# EAGLE schematic MPPT Charge Controller (EAGLE 9.6.2)
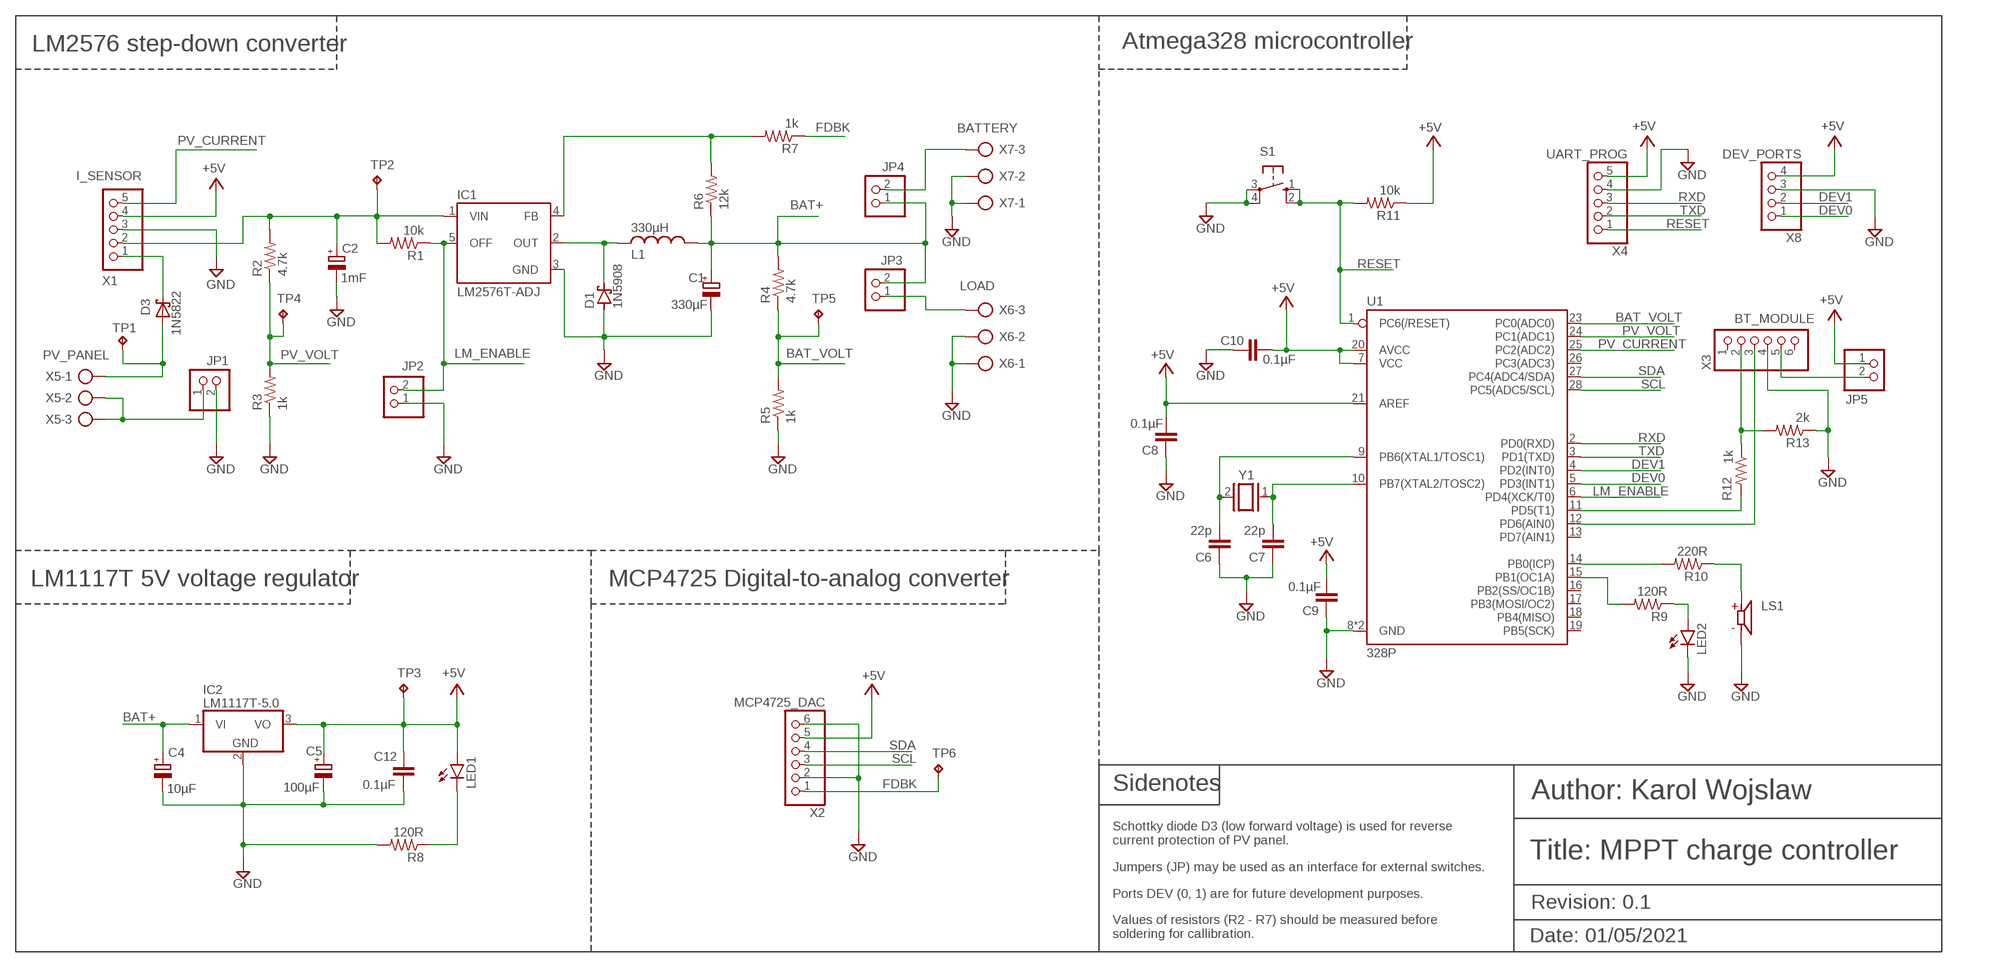
[diagram p0: schematic, sheet 1]

## Parts
C1  330µF  CPOL-EUE2-5  [E2-5]
C2  1mF  CPOL-EUE2-5  [E2-5]
C4  10µF  CPOL-EUE2-5  [E2-5]
C5  100µF  CPOL-EUE2-5  [E2-5]
C6  22p  C-EU025-025X050  [C025-025X050]
C7  22p  C-EU025-025X050  [C025-025X050]
C8  0.1µF  C2.5/2  [C2.5-2]
C9  0.1µF  C-EU025-025X050  [C025-025X050]
C10  0.1µF  C-EU025-025X050  [C025-025X050]
C12  0.1µF  C-EU025-025X050  [C025-025X050]
D1  1N5908  SCHOTTKY-DIODEDO201T15  [DO201T15]
D3  1N5822  SCHOTTKY-DIODEDO201T15  [DO201T15]
IC1  LM2576T-ADJ  LM2576T  [TO220-5]
IC2  LM1117T-5.0  7805TV  [TO220V]
JP1  PINHD-1X2  [1X02]
JP2  PINHD-1X2  [1X02]
JP3  PINHD-1X2  [1X02]
JP4  PINHD-1X2  [1X02]
JP5  PINHD-1X2  [1X02]
L1  330µH  L-US6000-XXX-RC  [6000-XXXX-RC]
LED1  LED5MM  [LED5MM]
LED2  LED5MM  [LED5MM]
LS1  CEM-1205C  [CUI_CEM-1205C]
R1  10k  R-US_0207/10  [0207/10]
R2  4.7k  R-US_0207/10  [0207/10]
R3  1k  R-US_0207/10  [0207/10]
R4  4.7k  R-US_0207/10  [0207/10]
R5  1k  R-US_0207/10  [0207/10]
R6  12k  R-US_0207/10  [0207/10]
R7  1k  R-US_0207/10  [0207/10]
R8  120R  R-US_0207/10  [0207/10]
R9  120R  R-US_0207/10  [0207/10]
R10  220R  R-US_0207/10  [0207/10]
R11  10k  R-US_0207/10  [0207/10]
R12  1k  R-US_0207/10  [0207/10]
R13  2k  R-US_0207/10  [0207/10]
S1  10-XX  [B3F-10XX]
TP1  TPPAD1-13  [P1-13]
TP2  TPPAD1-13  [P1-13]
TP3  TPPAD1-13  [P1-13]
TP4  TPPAD1-13  [P1-13]
TP5  TPPAD1-13  [P1-13]
TP6  TPPAD1-13  [P1-13]
U1  328P  ATMEGA328P_PDIP  [DIP28]
X1  I_SENSOR  PINHD-1X5  [1X05]
X2  MCP4725_DAC  PINHD-1X6  [1X06]
X3  BT_MODULE  PINHD-1X6  [1X06]
X4  UART_PROG  PINHD-1X5  [1X05]
X5  PV_PANEL  AK300/3  [AK300/3]
X6  LOAD  AK500/3  [AK500/3]
X7  BATTERY  AK500/3  [AK500/3]
X8  DEV_PORTS  PINHD-1X4  [1X04]
Y1  16MHz  XTAL/S  [QS]

## Nets
+5V: C5.+ C8.2 C9.2 C10.2 C12.2 IC2.3(VO) JP5.1 LED1.A R11.1 TP3.TP U1.7(VCC) U1.20(AVCC) U1.21(AREF) X1.4 X2.5 X4.5 X8.4
BAT+: C1.+ C4.+ IC2.1(VI) JP3.2 JP4.1 L1.1 R4.2 R6.1
BAT_VOLT: R4.1 R5.2 TP5.TP U1.23(PC0(ADC0))
BT_TXD: U1.12(PD6(AIN0)) X3.3
DEV0: U1.5(PD3(INT1)) X8.1
DEV1: U1.4(PD2(INT0)) X8.2
FDBK: R7.1 TP6.TP X2.1
GND: C1.- C2.- C4.- C5.- C6.1 C7.1 C8.1 C9.1 C10.1 C12.1 D1.A IC1.3(GND) IC2.2(GND) JP1.2 JP2.1 LED2.K(C) LS1.N R3.1 R5.1 R8.2 R13.1 S1.3(P) S1.4(P1) U1.8(GND) U1.22(GND) X1.3 X2.2 X2.6 X3.4 X4.4 X6.1 X6.2 X7.1 X7.2 X8.3
LM_ENABLE: IC1.5(OFF) JP2.2 R1.1 U1.6(PD4(XCK/T0))
LM_FEEDBACK: IC1.4(FB) R6.2 R7.2
LM_VIN: C2.+ IC1.1(VIN) R1.2 R2.2 TP2.TP X1.2
N$1: D1.C IC1.2(OUT) L1.2
N$2: D3.A TP1.TP X5.1
N$3: D3.C X1.1
N$4: LED1.K(C) R8.1
N$5: JP1.1 X5.2 X5.3
N$6: JP3.1 X6.3
N$7: C6.2 U1.9(PB6(XTAL1/TOSC1)) Y1.2
N$8: R10.2 U1.14(PB0(ICP))
N$10: JP4.2 X7.3
N$11: R9.2 U1.15(PB1(OC1A))
N$12: LED2.A R9.1
N$14: LS1.P R10.1
N$15: R12.2 U1.11(PD5(T1))
N$16: R12.1 R13.2 X3.2
N$18: JP5.2 X3.5
N$19: C7.2 U1.10(PB7(XTAL2/TOSC2)) Y1.1
PV_CURRENT: U1.25(PC2(ADC2)) X1.5
PV_VOLT: R2.1 R3.2 TP4.TP U1.24(PC1(ADC1))
RESET: R11.2 S1.1(S) S1.2(S1) U1.1(PC6(/RESET)) X4.1
RXD: U1.2(PD0(RXD)) X4.3
SCL: U1.28(PC5(ADC5/SCL)) X2.3
SDA: U1.27(PC4(ADC4/SDA)) X2.4
TXD: U1.3(PD1(TXD)) X4.2
Unconnected: U1.13(PD7(AIN1)) U1.16(PB2(SS/OC1B)) U1.17(PB3(MOSI/OC2)) U1.18(PB4(MISO)) U1.19(PB5(SCK)) U1.26(PC3(ADC3)) X3.1 X3.6

## Notes on the sheet
- LM2576 step-down converter | Atmega328 microcontroller
- LM1117T 5V voltage regulator | MCP4725 Digital-to-analog converter
- Sidenotes
- Author: Karol Wojslaw
- Schottky diode D3 (low forward voltage) is used for reverse
  current protection of PV panel.
- Title: MPPT charge controller
- Jumpers (JP) may be used as an interface for external switches.
- Ports DEV (0, 1) are for future development purposes.
- Revision: 0.1
- Values of resistors (R2 - R7) should be measured before
  soldering for callibration.
- Date: 01/05/2021

## Library data of the parts
C1 C2 C4 C5 = rcl:CPOL-EU: POLARIZED CAPACITOR, European symbol; SPICEPREFIX: C
C6 C7 C9 C10 C12 = rcl:C-EU: CAPACITOR, European symbol; SPICEPREFIX: C
C8 = capacitor-wima:C: CAPACITOR naming: grid - package width
D1 = diode:SCHOTTKY-DIODE: Schottky Diode
D3 = adafruit:SCHOTTKY-DIODE: Schottky Diode
IC1 = LM2576_eagle_lib:LM2576: National Semiconductor <http://www.national.com> 3.0A "Simple Switcher"(c) 52kHz, Vout 1.23-37V (HV: 57V), Vin 40V (HV: 60V), 50µA standby current
IC2 = linear:78*: Positive VOLTAGE REGULATOR Source: http://cache.national.com/ds/LM/LM78L05.pdf http://www.fairchildsemi.com/ds/LM/LM7805.pdf
JP1-JP5 = pinhead:PINHD-1X2: PIN HEADER
L1 = rcl:L-US: INDUCTOR, American symbol; SPICEPREFIX: L
LED1 LED2 = led:LED: LED OSRAM: - CHIPLED LG R971, LG N971, LY N971, LG Q971, LY Q971, LO R971, LY R971 LH N974, LH R974 LS Q976, LO Q976, LY Q976 LO Q996 - Hyper CHIPLED LW Q18S LB Q993, LB Q99A, LB R99A - SideLED LS A670, LO A670, LY A670, LG A670, LP A670 LB A673, LV A673, LT A673, LW A673 LH A674 LY A675 LS A676, LA A676, LO A676, LY A676, LW A676 LS A679, LY A679, LG A679 - Hyper Micro SIDELED® LS Y876, LA Y876, LO Y876, LY Y876 LT Y87S - SmartLED LW L88C, LW L88S LB L89C, LB L89S, LG L890 LS L89K, LO L89K, LY L89K LS L896, LA L896, LO L896, LY L896 - TOPLED LS T670, LO T670, LY T670, LG T670, LP T670 LSG T670, LSP T670, LSY T670, LOP T670, LYG T670 LG T671, LOG T671, LSG T671 LB T673, LV T673, LT T673, LW T673 LH T674 LS T676, LA T676, LO T676, LY T676, LB T676, LH T676, LSB T676, LW T676 LB T67C, LV T67C, LT T67C, LS T67K, LO T67K, LY T67K, LW E67C LS E67B, LA E67B, LO E67B, LY E67B, LB E67C, LV E67C, LT E67C LW T67C LS T679, LY T679, LG T679 LS T770, LO T770, LY T770, LG T770, LP T770 LB T773, LV T773, LT T773, LW T773 LH T774 LS E675, LA E675, LY E675, LS T675 LS T776, LA T776, LO T776, LY T776, LB T776 LHGB T686 LT T68C, LB T68C - Hyper Mini TOPLED® LB M676 - Mini TOPLED Santana® LG M470 LS M47K, LO M47K, LY M47K Source: http://www.osram.convergy.de LUXEON: - LUMILED® LXK2-PW12-R00, LXK2-PW12-S00, LXK2-PW14-U00, LXK2-PW14-V00 LXK2-PM12-R00, LXK2-PM12-S00, LXK2-PM14-U00 LXK2-PE12-Q00, LXK2-PE12-R00, LXK2-PE12-S00, LXK2-PE14-T00, LXK2-PE14-U00 LXK2-PB12-K00, LXK2-PB12-L00, LXK2-PB12-M00, LXK2-PB14-N00, LXK2-PB14-P00, LXK2-PB14-Q00 LXK2-PR12-L00, LXK2-PR12-M00, LXK2-PR14-Q00, LXK2-PR14-R00 LXK2-PD12-Q00, LXK2-PD12-R00, LXK2-PD12-S00 LXK2-PH12-R00, LXK2-PH12-S00 LXK2-PL12-P00, LXK2-PL12-Q00, LXK2-PL12-R00 Source: www.luxeon.com KINGBRIGHT: KA-3528ASYC Source: www.kingbright.com
LS1 = CEM-1205C:CEM-1205C: 12 mm, 5 V, 85 dB, Through Hole, Sealed, Driving Circuit, Magnetic Audio Indicator Buzzer Check prices <https://pricing.snapeda.com/parts/CEM-1205C/CUI%20Devices/view-part?ref=eda>; AVAILABILITY: Good; CUI_PURCHASE_URL: https://www.cuidevices.com/product/audio/buzzers/audio-indicators/cem-1205c?utm_source=snapeda.com&utm_medium=referral&utm_campaign=snapedaBOM; DESCRIPTION: 12 mm, 5 V, 85 dB, Through Hole, Sealed, Driving Circuit, Magnetic Audio Indicator Buzzer; MF: CUI Devices; MP: CEM-1205C; PACKAGE: TO-220 CUI Inc.; PRICE: None; PURCHASE-URL: https://pricing.snapeda.com/search/part/CEM-1205C/?ref=eda
R1-R13 = rcl:R-US_: RESISTOR, American symbol; SPICEPREFIX: R
S1 = switch-omron:10-XX: OMRON SWITCH; MPN: B3F-1000; OC_FARNELL: 176432; OC_NEWARK: 36M3542
TP1-TP6 = testpad:TP: Test pad
U1 = SparkFun-IC-Microcontroller:ATMEGA328P_PDIP: Atmel 328P Through hole ATMEGA328P uC used in the Arduino 32kb flash, 1k EEPROM, 2k SRAM Datasheet <http://www.sparkfun.com/datasheets/Components/SMD/ATMega328.pdf> SparkFun Products Storefront component: AVR 28 Pin 20MHz 32K 6A/D - ATMega328P <https://www.sparkfun.com/products/9061> (COM-09061) SparkFun Simon Says - Through-Hole Soldering Kit <https://www.sparkfun.com/products/10547> (KIT-10547) SparkFun Learn to Solder - Simon Says <https://www.sparkfun.com/products/13708> (KIT-13708) SparkFun BigTime Watch Kit <https://www.sparkfun.com/products/11734> (KIT-11734) SparkFun ClockIt <https://www.sparkfun.com/products/10930> (KIT-10930) SparkFun Serial Enabled LCD Kit <https://www.sparkfun.com/products/10097> (LCD-10097) SparkFun Simon Tilts - Through Hole Soldering Kit <https://www.sparkfun.com/products/12634> (KIT-12634) SparkFun Frequency Counter Kit <https://www.sparkfun.com/products/10140> (KIT-10140) FabFM Radio Kit <https://www.sparkfun.com/products/11043> (KIT-11043) SparkFun Binary Blaster Kit <https://www.sparkfun.com/products/12037> (KIT-12037) SparkFun Metro-Gnome <https://www.sparkfun.com/products/9236> (KIT-09236) ATmega328 with Arduino Optiboot (Uno) <https://www.sparkfun.com/products/10524> (DEV-10524); PROD_ID: IC-09136
X1 X4 = pinhead:PINHD-1X5: PIN HEADER
X2 X3 = pinhead:PINHD-1X6: PIN HEADER
X5 = con-ptr500:AK300/3: CONNECTOR; OC_FARNELL: unknown; OC_NEWARK: unknown
X6 X7 = con-ptr500:AK500/3: CONNECTOR; OC_FARNELL: unknown; OC_NEWARK: unknown
X8 = pinhead:PINHD-1X4: PIN HEADER
Y1 = special:XTAL/S: CRYSTAL